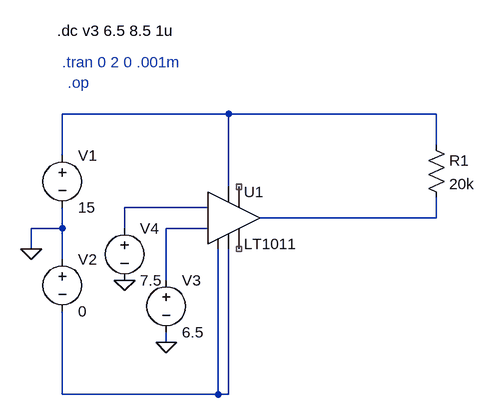
[diagram p0: schematic comparadorLt1011_2.asc]
comparadorLt1011_2.asc, the LTspice schematic file:
Version 4
SHEET 1 1044 680
WIRE 192 0 -64 0
WIRE 512 0 192 0
WIRE 512 48 512 0
WIRE -64 64 -64 0
WIRE 192 112 192 0
WIRE 160 144 32 144
WIRE 512 160 512 128
WIRE 512 160 240 160
WIRE -64 176 -64 144
WIRE -64 176 -112 176
WIRE 32 176 32 144
WIRE 160 176 96 176
WIRE -112 208 -112 176
WIRE -64 224 -64 176
WIRE 96 256 96 176
WIRE 96 352 96 336
WIRE -64 432 -64 304
WIRE 176 432 176 208
WIRE 176 432 -64 432
WIRE 192 432 192 208
WIRE 192 432 176 432
FLAG -112 208 0
FLAG 96 352 0
FLAG 32 256 0
DATAFLAG 464 160 ""
SYMBOL Comparators\\LT1011 192 160 R0
SYMATTR InstName U1
SYMBOL voltage -64 48 R0
WINDOW 123 0 0 Left 0
WINDOW 39 0 0 Left 0
SYMATTR InstName V1
SYMATTR Value 15
SYMBOL voltage -64 208 R0
WINDOW 123 0 0 Left 0
WINDOW 39 0 0 Left 0
SYMATTR InstName V2
SYMATTR Value 0
SYMBOL res 496 32 R0
SYMATTR InstName R1
SYMATTR Value 20k
SYMBOL voltage 96 240 R0
WINDOW 123 0 0 Left 0
WINDOW 39 0 0 Left 0
SYMATTR InstName V3
SYMATTR Value 6.5
SYMBOL voltage 32 160 R0
WINDOW 123 0 0 Left 0
WINDOW 39 0 0 Left 0
SYMATTR InstName V4
SYMATTR Value 7.5
TEXT -64 -80 Left 2 ;.tran 0 2 0 .001m
TEXT -72 -128 Left 2 !.dc v3 6.5 8.5 1u
TEXT -56 -48 Left 2 ;.op

The netlist it stands for:
* comparadorLt1011_2.asc
XU1 N005 N004 N002 N005 NC_01 NC_02 N003 N001 LT1011
V1 N001 0 15
V2 0 N005 0
R1 N001 N003 20k
V3 N004 0 6.5
V4 N002 0 7.5
* .tran 0 2 0 .001m
.dc v3 6.5 8.5 1u
* .op
.lib LTC1.lib
.backanno
.end